# Altium schematic sheet GAL16V8D-15QP.SchDoc
size A4
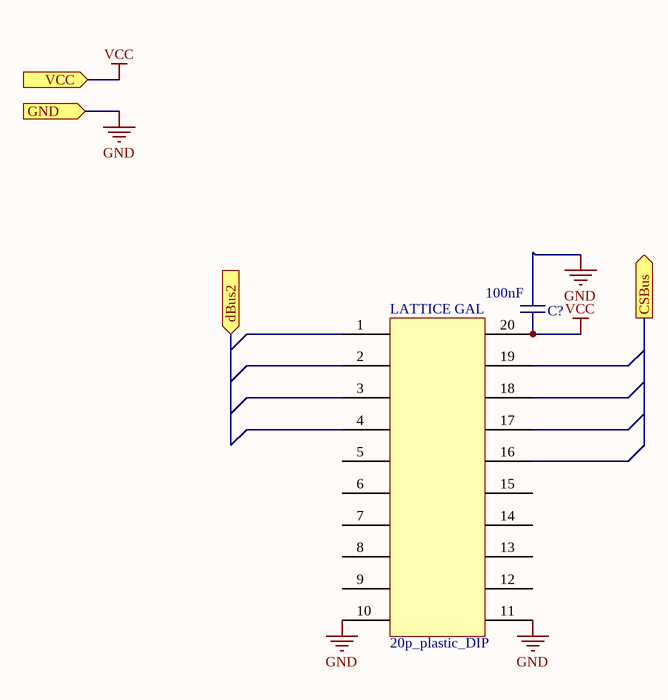
[diagram p0: GAL16V8D-15QP.SchDoc]

## Parts
C?  100nF  [CAPC0603(1608)55_N]
LATTICE_GAL  20p_plastic_DIP

## Ports
CSBus (out), dBus2 (in), GND (in), VCC (in)

## Nets
GND: C?.2 LATTICE_GAL.11 ; port GND
VCC: C?.1 LATTICE_GAL.20 ; port VCC

Not connected (* = marked no-connect by the designer): LATTICE_GAL 1 2 3 4 5 6 7 8 9 10 12 13 14 15 16 17 18 19

## Notes on the sheet
- Labels drawn without touching a wire or pin: GND

## Library data of the parts
C? = 3934: Capacitor; id: 3934; pakke_opprettet_av: 815; navn: 220nF; pris: 0; nokkelord: kondensator; pakketype: 0603; pakke_opprettet: 18.02.2015 14:18:13; symbol_opprettet_av: 815; symbol_opprettet: 14.11.2014 20:19:34